# EAGLE schematic encoder (EAGLE 7.2.0)
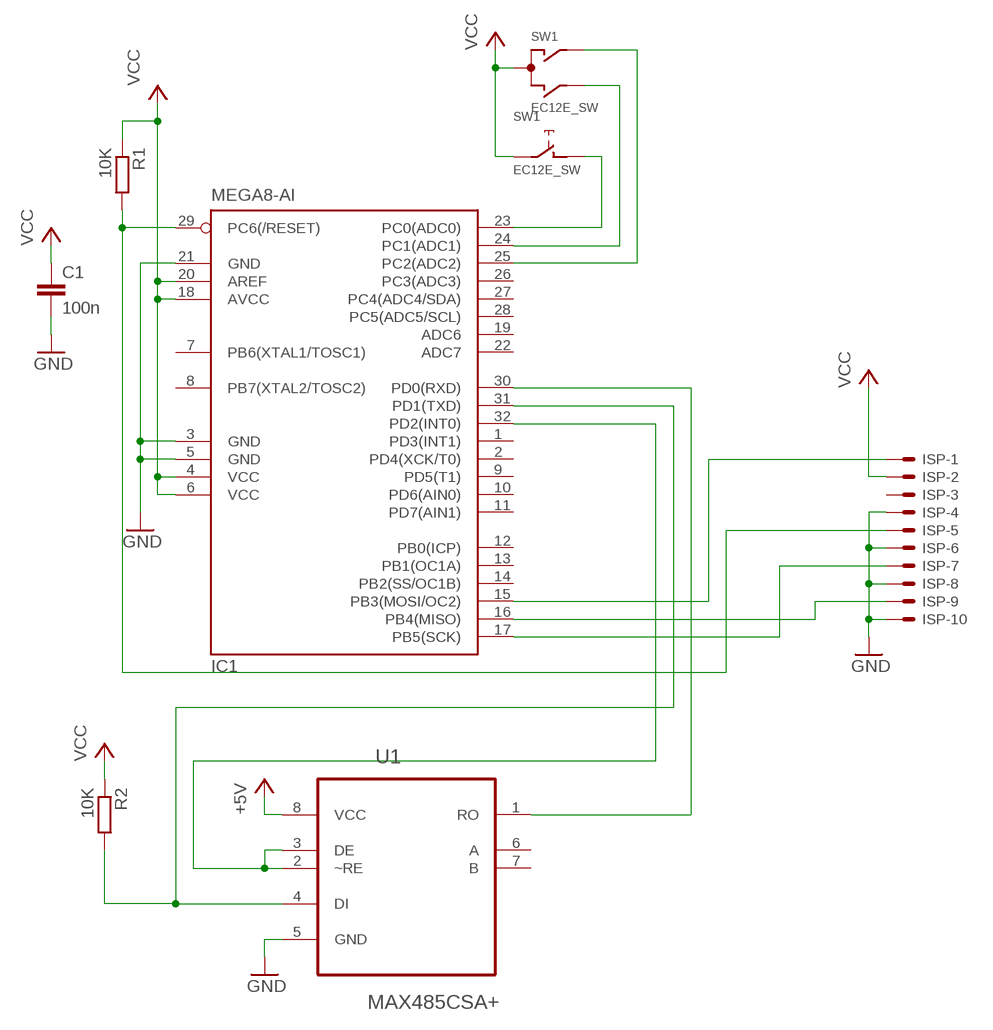
[diagram p0: schematic, sheet 1]

## Parts
C1  100n  C2,5-3  [C2.5-3]
IC1  MEGA8-AI  [TQFP32-08]
ISP  5566-10  [5566-10]
R1  10K  R-EU_M1206  [M1206]
R2  10K  R-EU_M1206  [M1206]
SW1  EC12E_SW  [ALPS_EC12E_SW]
U1  MAX485CSA+  [SOIC127P600X175-8N]

## Nets
+5V: U1.8(VCC)
GND: C1.2 IC1.3(GND) IC1.5(GND) IC1.21(GND) ISP.4 ISP.6 ISP.8 ISP.10 U1.5(GND)
N$1: IC1.31(PD1(TXD)) R2.2 U1.4(DI)
N$2: IC1.30(PD0(RXD)) U1.1(RO)
N$3: IC1.32(PD2(INT0)) U1.2(~RE) U1.3(DE)
N$4: IC1.17(PB5(SCK)) ISP.7
N$5: IC1.25(PC2(ADC2)) SW1.A
N$6: IC1.15(PB3(MOSI/OC2)) ISP.1
N$7: IC1.16(PB4(MISO)) ISP.9
N$9: IC1.24(PC1(ADC1)) SW1.B
N$10: IC1.23(PC0(ADC0)) SW1.D
N$11: IC1.29(PC6(/RESET)) ISP.5 R1.2
VCC: C1.1 IC1.4(VCC) IC1.6(VCC) IC1.18(AVCC) IC1.20(AREF) ISP.2 R1.1 R2.1 SW1.C SW1.E
Unconnected: IC1.1(PD3(INT1)) IC1.2(PD4(XCK/T0)) IC1.7(PB6(XTAL1/TOSC1)) IC1.8(PB7(XTAL2/TOSC2)) IC1.9(PD5(T1)) IC1.10(PD6(AIN0)) IC1.11(PD7(AIN1)) IC1.12(PB0(ICP)) IC1.13(PB1(OC1A)) IC1.14(PB2(SS/OC1B)) IC1.19(ADC6) IC1.22(ADC7) IC1.26(PC3(ADC3)) IC1.27(PC4(ADC4/SDA)) IC1.28(PC5(ADC5/SCL)) ISP.3 SW1.GND1(G) SW1.GND2(G) U1.6(A) U1.7(B)

## Library data of the parts
C1 = capacitor-wima:C: CAPACITOR naming: grid - package width
IC1 = atmel:MEGA8: MICROCONTROLLER 8 Kbytes FLASH, 1 kbytes SRAM, 512 bytes EEPROM, USART, 6-channel 10 bit ADC, 2-channel 8 bit ADC Pin compatible with Atmega48, ATMega88, ATMega168 Source: avr.lbr; MPN: ATMEGA8-16AU; OC_FARNELL: 9171371; OC_NEWARK: 73M8863
ISP = con-molex:5566-10: Mini FIT connector 10 pol Source: http://www.molex.com; OC_FARNELL: unknown; OC_NEWARK: unknown
R1 R2 = resistor:R-EU_: RESISTOR, European symbol
SW1 = switch-alps:EC12E_SW: ALPS rotary Encoder EC12E series with switch; MPN: EC12E2424407; OC_FARNELL: 1520813; OC_NEWARK: 74M1068
U1 = Maxim_By_element14_Batch_1:MAX485CSA+: ±15kV ESD-Protected, Slew-Rate-Limited, Low-Power, RS-485/RS-422 Transceivers; MPN: MAX485CSA+; OC_FARNELL: 9725954; OC_NEWARK: 68K4795; PACKAGE: SOIC-8; SUPPLIER: Maxim